# Altium schematic sheet koosh_connector.SchDoc
size A
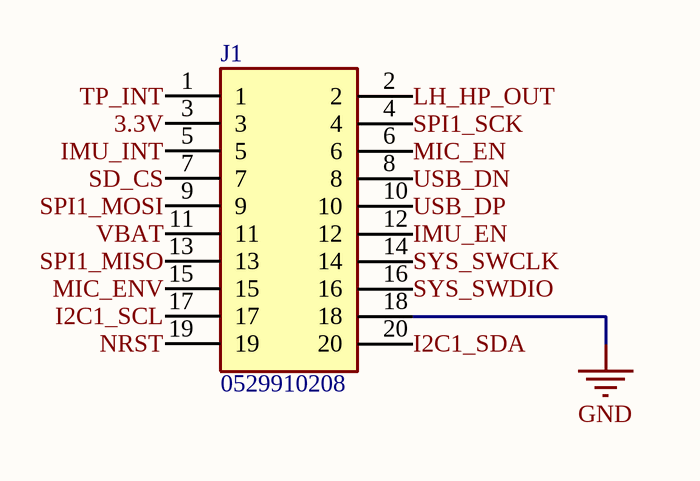
[diagram p0: koosh_connector.SchDoc]

## Parts
J1  0529910208  [0529910208]

## Nets
GND: J1.18
3.3V: J1.3
I2C1_SCL: J1.17
I2C1_SDA: J1.20
IMU_EN: J1.12
IMU_INT: J1.5
LH_HP_OUT: J1.2
MIC_EN: J1.6
MIC_ENV: J1.15
NRST: J1.19
SD_CS: J1.7
SPI1_MISO: J1.13
SPI1_MOSI: J1.9
SPI1_SCK: J1.4
SYS_SWCLK: J1.14
SYS_SWDIO: J1.16
TP_INT: J1.1
USB_DN: J1.8
USB_DP: J1.10
VBAT: J1.11

## Library data of the parts
J1 = 0529910208: Connector; Manufacturer_Name: Molex; Datasheet Link: https://www.molex.com/pdm_docs/sd/529910208_sd.pdf; Height: 2.47mm; Manufacturer_Part_Number: 0529910208